# Altium project V5_BASE.PrjPcb
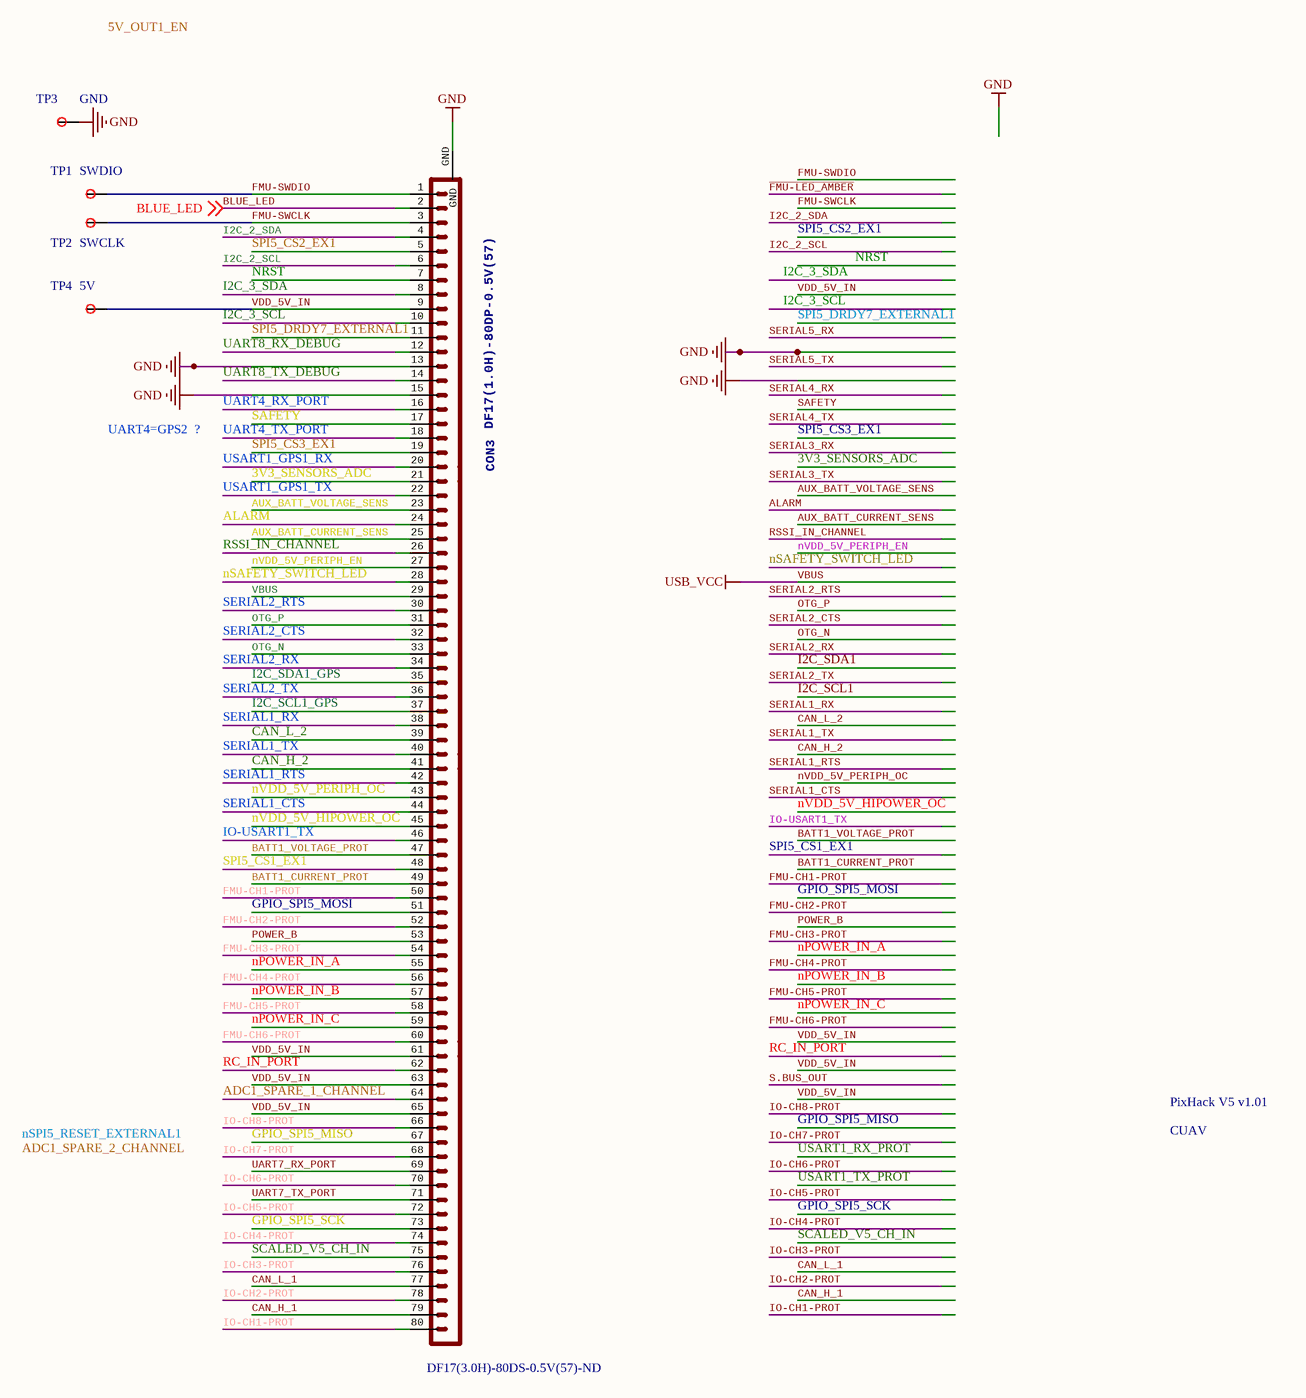
[diagram p0: 02_B_TO_B_CON.SchDoc]
4 sheets, 59 parts. Net scope: global (net labels, ports and power ports of the same name join across sheets).
Board file: V5_BASE_V15.PcbDoc
Sheets:
  02_B_TO_B_CON.SchDoc
  05_DATA_IO.SchDoc
  06_PWM_IO.SchDoc
  07_ONB_COMPASS.SchDoc

## Sheet 02_B_TO_B_CON.SchDoc
size A3

### Parts
CON3  DF17(1.0H)-80DP-0.5V(57)  Supplier Part Number 1: DF17(3.0H)-80DS-0.5V(57)-ND  [DF17(1.0H)-80DP-0.5V(57)]
PixHack_V5_v1.01  CUAV  [CUAV]
TP1  SWDIO  [TP0.75]
TP2  SWCLK  [TP0.75]
TP3  GND  [TP0.75]
TP4  5V  [TP0.75]

### Nets
GND: CON3.13 CON3.15 CON3.GND TP3.0
VBUS: CON3.29  [also labelled USB_VCC]
VDD_5V_IN: CON3.9 CON3.61 CON3.63 CON3.65 TP4.0
3V3_SENSORS_ADC: CON3.21
ADC1_SPARE_1_CHANNEL: CON3.64
ALARM: CON3.24
AUX_BATT_CURRENT_SENS: CON3.25
AUX_BATT_VOLTAGE_SENS: CON3.23
BATT1_CURRENT_PROT: CON3.49
BATT1_VOLTAGE_PROT: CON3.47
BLUE_LED: CON3.2 ; off-sheet BLUE_LED
CAN_H_1: CON3.79
CAN_H_2: CON3.41
CAN_L_1: CON3.77
CAN_L_2: CON3.39
FMU-CH1-PROT: CON3.50
FMU-CH2-PROT: CON3.52
FMU-CH3-PROT: CON3.54
FMU-CH4-PROT: CON3.56
FMU-CH5-PROT: CON3.58
FMU-CH6-PROT: CON3.60
FMU-SWCLK: CON3.3 TP2.0
FMU-SWDIO: CON3.1 TP1.0
GPIO_SPI5_MISO: CON3.67
GPIO_SPI5_MOSI: CON3.51
GPIO_SPI5_SCK: CON3.73
I2C_2_SCL: CON3.6
I2C_2_SDA: CON3.4
I2C_3_SCL: CON3.10
I2C_3_SDA: CON3.8
I2C_SCL1_GPS: CON3.37
I2C_SDA1_GPS: CON3.35
IO-CH1-PROT: CON3.80
IO-CH2-PROT: CON3.78
IO-CH3-PROT: CON3.76
IO-CH4-PROT: CON3.74
IO-CH5-PROT: CON3.72
IO-CH6-PROT: CON3.70
IO-CH7-PROT: CON3.68
IO-CH8-PROT: CON3.66
IO-USART1_TX: CON3.46
nPOWER_IN_A: CON3.55
nPOWER_IN_B: CON3.57
nPOWER_IN_C: CON3.59
NRST: CON3.7
nSAFETY_SWITCH_LED: CON3.28
nVDD_5V_HIPOWER_OC: CON3.45
nVDD_5V_PERIPH_EN: CON3.27
nVDD_5V_PERIPH_OC: CON3.43
OTG_N: CON3.33
OTG_P: CON3.31
POWER_B: CON3.53
RC_IN_PORT: CON3.62
RSSI_IN_CHANNEL: CON3.26
SAFETY: CON3.17
SCALED_V5_CH_IN: CON3.75
SERIAL1_CTS: CON3.44
SERIAL1_RTS: CON3.42
SERIAL1_RX: CON3.38
SERIAL1_TX: CON3.40
SERIAL2_CTS: CON3.32
SERIAL2_RTS: CON3.30
SERIAL2_RX: CON3.34
SERIAL2_TX: CON3.36
SPI5_CS1_EX1: CON3.48
SPI5_CS2_EX1: CON3.5
SPI5_CS3_EX1: CON3.19
SPI5_DRDY7_EXTERNAL1: CON3.11
UART4_RX_PORT: CON3.16
UART4_TX_PORT: CON3.18
UART7_RX_PORT: CON3.69
UART7_TX_PORT: CON3.71
UART8_RX_DEBUG: CON3.12
UART8_TX_DEBUG: CON3.14
USART1_GPS1_RX: CON3.20
USART1_GPS1_TX: CON3.22

### Notes on the sheet
- Labels drawn without touching a wire or pin: 5V_OUT1_EN, ADC1_SPARE_2_CHANNEL, nSPI5_RESET_EXTERNAL1, UART4=GPS2  ?

### Library data of the parts
CON3 = CON-DF17-80F: CONN RECEPT 80POS .5MM SMD W/FIT; 3DR_PARTNO: ECM0518; PARTNO: DF17(3.0H)-80DS-0.5V(57); Supplier 1: Digi-Key
TP1-TP4 = TP_0.75: TP_0.75MM

## Sheet 05_DATA_IO.SchDoc
size A4
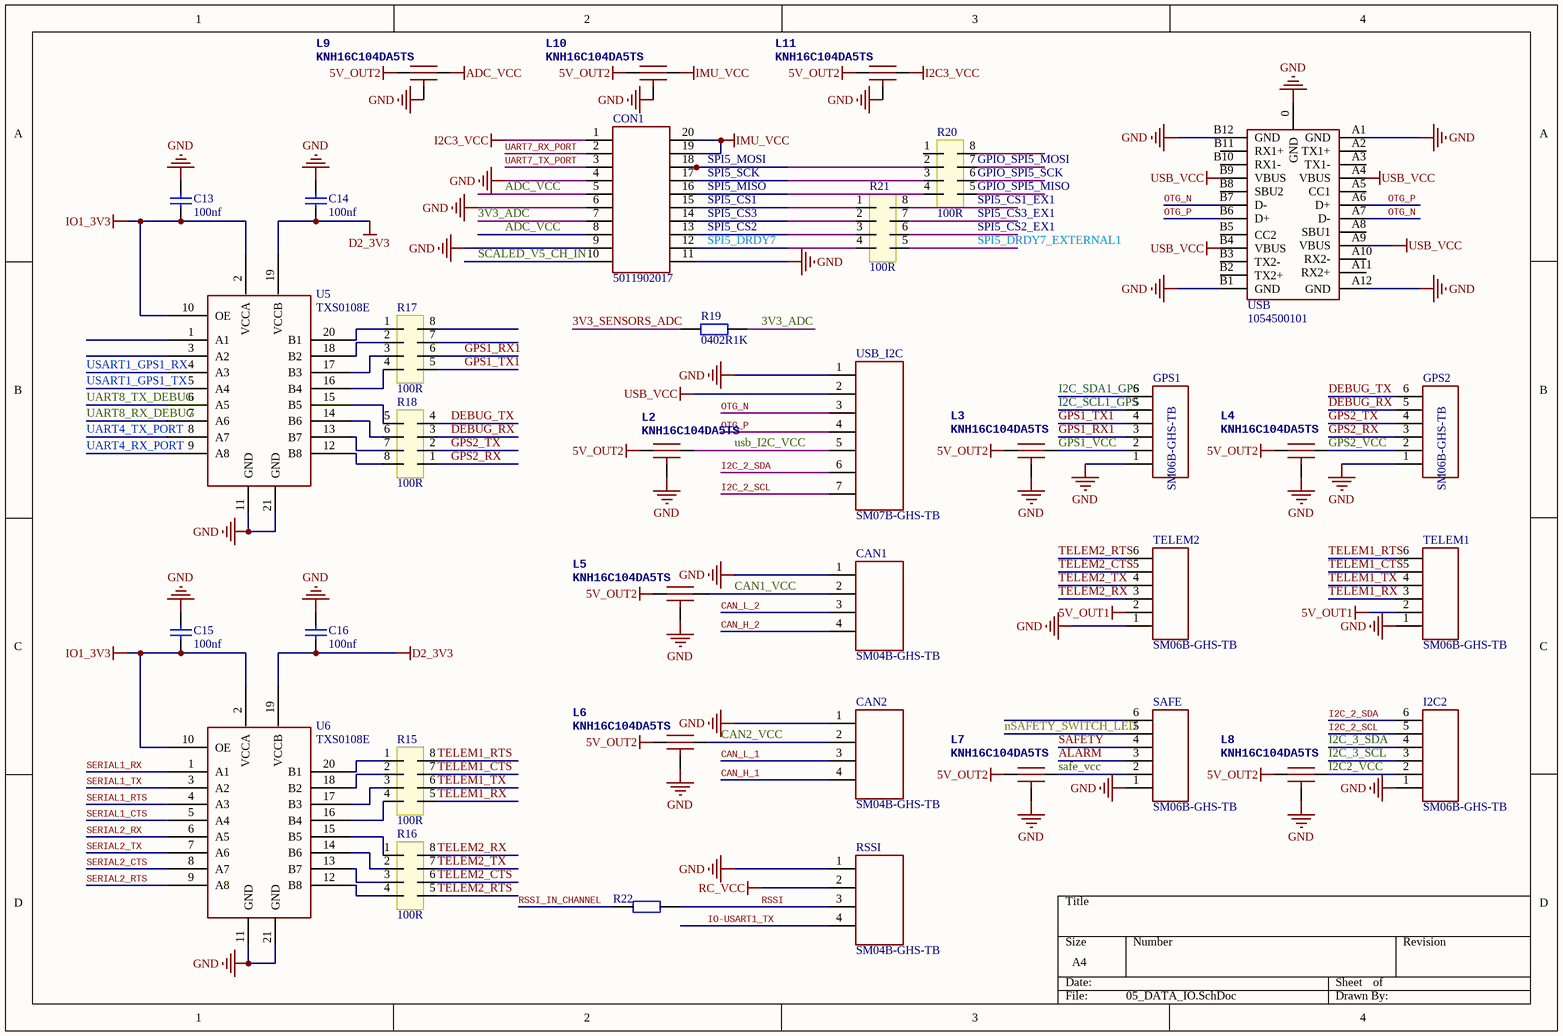
[diagram p1: 05_DATA_IO.SchDoc]

### Parts
C13  100nf  [0402CAP]
C14  100nf  [0402CAP]
C15  100nf  [0402CAP]
C16  100nf  [0402CAP]
CAN1  SM04B-GHS-TB  [BM04B-GHS]
CAN2  SM04B-GHS-TB  [BM04B-GHS]
CON1  5011902017  [5011902017]
GPS1  SM06B-GHS-TB  [SM06B-GHS-TB]
GPS2  SM06B-GHS-TB  [SM06B-GHS-TB]
I2C2  SM06B-GHS-TB  [SM06B-GHS-TB]
L2  KNH16C104DA5TS  [KYOCERA-KNH16-DA]
L3  KNH16C104DA5TS  [KYOCERA-KNH16-DA]
L4  KNH16C104DA5TS  [KYOCERA-KNH16-DA]
L5  KNH16C104DA5TS  [KYOCERA-KNH16-DA]
L6  KNH16C104DA5TS  [KYOCERA-KNH16-DA]
L7  KNH16C104DA5TS  [KYOCERA-KNH16-DA]
L8  KNH16C104DA5TS  [KYOCERA-KNH16-DA]
L9  KNH16C104DA5TS  [KYOCERA-KNH16-DA]
L10  KNH16C104DA5TS  [KYOCERA-KNH16-DA]
L11  KNH16C104DA5TS  [KYOCERA-KNH16-DA]
R15  100R  [0402_4r]
R16  100R  [0402_4r]
R17  100R  [0402_4r]
R18  100R  [0402_4r]
R19  0402R1K  [0402R]
R20  100R  [0402_4r]
R21  100R  [0402_4r]
R22  0402R100R  [0402R]  (value not drawn)
RSSI  SM04B-GHS-TB  [BM04B-GHS]
SAFE  SM06B-GHS-TB  [SM06B-GHS-TB]
TELEM1  SM06B-GHS-TB  [SM06B-GHS-TB]
TELEM2  SM06B-GHS-TB  [SM06B-GHS-TB]
U5  TXS0108E  [VQFN20]
U6  TXS0108E  [VQFN20]
USB  1054500101  [1054500101]
USB_I2C  SM07B-GHS-TB  [SM07B-GHS-TB]

### Nets
5V_OUT1: TELEM1.2 TELEM2.2
5V_OUT2: L2.P$1 L3.P$1 L4.P$1 L5.P$1 L6.P$1 L7.P$1 L8.P$1 L9.P$1 L10.P$1 L11.P$1
ADC_VCC: CON1.5 CON1.8 L9.P$2
D2_3V3: C14.2 C16.2 U5.19(VCCB) U6.19(VCCB)
GND: C13.1 C14.1 C15.1 C16.1 CAN1.1 CAN2.1 CON1.4 CON1.6 CON1.9 CON1.11 GPS1.1 GPS2.1 I2C2.1 L2.GND L3.GND L4.GND L5.GND L6.GND L7.GND L8.GND L9.GND L10.GND L11.GND RSSI.1 SAFE.1 TELEM1.1 TELEM2.1 U5.11(GND) U5.21(GND) U6.11(GND) U6.21(GND) USB.0(GND) USB.A1(GND) USB.A12(GND) USB.B1(GND) USB.B12(GND) USB_I2C.1
I2C3_VCC: CON1.1 L11.P$2
IMU_VCC: CON1.19 CON1.20 L10.P$2
IO1_3V3: C13.2 C15.2 U5.2(VCCA) U5.10(OE) U6.2(VCCA) U6.10(OE)
RC_VCC: RSSI.2
USB_VCC: USB.A4(VBUS) USB.A9(VBUS) USB.B4(VBUS) USB.B9(VBUS) USB_I2C.2  [project net VBUS]
3V3_ADC: CON1.7 R19.2
3V3_SENSORS_ADC: R19.1
ALARM: SAFE.3
CAN1_VCC: CAN1.2 L5.P$2
CAN2_VCC: CAN2.2 L6.P$2
CAN_H_1: CAN2.4
CAN_H_2: CAN1.4
CAN_L_1: CAN2.3
CAN_L_2: CAN1.3
DEBUG_RX: GPS2.5 R18.3
DEBUG_TX: GPS2.6 R18.4
GPIO_SPI5_MISO: R20.5
GPIO_SPI5_MOSI: R20.7
GPIO_SPI5_SCK: R20.6
GPS1_RX1: GPS1.3 R17.6
GPS1_TX1: GPS1.4 R17.5
GPS1_VCC: GPS1.2 L3.P$2
GPS2_RX: GPS2.3 R18.1
GPS2_TX: GPS2.4 R18.2
GPS2_VCC: GPS2.2 L4.P$2
I2C2_VCC: I2C2.2 L8.P$2
I2C_2_SCL: I2C2.5 USB_I2C.7
I2C_2_SDA: I2C2.6 USB_I2C.6
I2C_3_SCL: I2C2.3
I2C_3_SDA: I2C2.4
I2C_SCL1_GPS: GPS1.5
I2C_SDA1_GPS: GPS1.6
IO-USART1_TX: RSSI.4
nSAFETY_SWITCH_LED: SAFE.5
OTG_N: USB.A7(D-) USB.B7(D-) USB_I2C.3
OTG_P: USB.A6(D+) USB.B6(D+) USB_I2C.4
RSSI: R22.2 RSSI.3
RSSI_IN_CHANNEL: R22.1
safe_vcc: L7.P$2 SAFE.2
SAFETY: SAFE.4
SCALED_V5_CH_IN: CON1.10
SERIAL1_CTS: U6.5(A4)
SERIAL1_RTS: U6.4(A3)
SERIAL1_RX: U6.1(A1)
SERIAL1_TX: U6.3(A2)
SERIAL2_CTS: U6.8(A7)
SERIAL2_RTS: U6.9(A8)
SERIAL2_RX: U6.6(A5)
SERIAL2_TX: U6.7(A6)
SPI5_CS1: CON1.15 R21.1
SPI5_CS1_EX1: R21.8
SPI5_CS2: CON1.13 R21.3
SPI5_CS2_EX1: R21.6
SPI5_CS3: CON1.14 R21.2
SPI5_CS3_EX1: R21.7
SPI5_DRDY7: CON1.12 R21.4
SPI5_DRDY7_EXTERNAL1: R21.5
SPI5_MISO: CON1.16 R20.4
SPI5_MOSI: CON1.18 R20.2
SPI5_SCK: CON1.17 R20.3
TELEM1_CTS: R15.7 TELEM1.5
TELEM1_RTS: R15.8 TELEM1.6
TELEM1_RX: R15.5 TELEM1.3
TELEM1_TX: R15.6 TELEM1.4
TELEM2_CTS: R16.6 TELEM2.5
TELEM2_RTS: R16.5 TELEM2.6
TELEM2_RX: R16.8 TELEM2.3
TELEM2_TX: R16.7 TELEM2.4
UART4_RX_PORT: U5.9(A8)
UART4_TX_PORT: U5.8(A7)
UART7_RX_PORT: CON1.2
UART7_TX_PORT: CON1.3
UART8_RX_DEBUG: U5.7(A6)
UART8_TX_DEBUG: U5.6(A5)
USART1_GPS1_RX: U5.4(A3)
USART1_GPS1_TX: U5.5(A4)
usb_I2C_VCC: L2.P$2 USB_I2C.5
NetR15_1: R15.1 U6.20(B1)
NetR15_2: R15.2 U6.18(B2)
NetR15_3: R15.3 U6.17(B3)
NetR15_4: R15.4 U6.16(B4)
NetR16_1: R16.1 U6.15(B5)
NetR16_2: R16.2 U6.14(B6)
NetR16_3: R16.3 U6.13(B7)
NetR16_4: R16.4 U6.12(B8)
NetR17_1: R17.1 U5.20(B1)
NetR17_2: R17.2 U5.18(B2)
NetR17_3: R17.3 U5.17(B3)
NetR17_4: R17.4 U5.16(B4)
NetR18_5: R18.5 U5.15(B5)
NetR18_6: R18.6 U5.14(B6)
NetR18_7: R18.7 U5.13(B7)
NetR18_8: R18.8 U5.12(B8)

Not connected (* = marked no-connect by the designer): R17 7 8; R20 1 8; SAFE 6; U5 1(A1) 3(A2); USB A2(TX1+) A3(TX1-) A5(CC1) A8(SBU1) A10(RX2-) A11(RX2+) B2(TX2+) B3(TX2-) B5(CC2) B8(SBU2) B10(RX1-) B11(RX1+)

### Library data of the parts
C13-C16 = Cap
L2-L11 = KNH16C104DA5TS: Capacitor, Filter, 0.1uF, 25V, 2A, 0603, SMD; 3DR_PARTNO: ECM0719; Supplier 1: Digi-Key
R15-R18 R20 R21 = 0402-8R-4R
R19 = 0402R1K: 0402R1K 1%
R22 = 0402R100R: 0402R100R 1%

## Sheet 06_PWM_IO.SchDoc
size A4
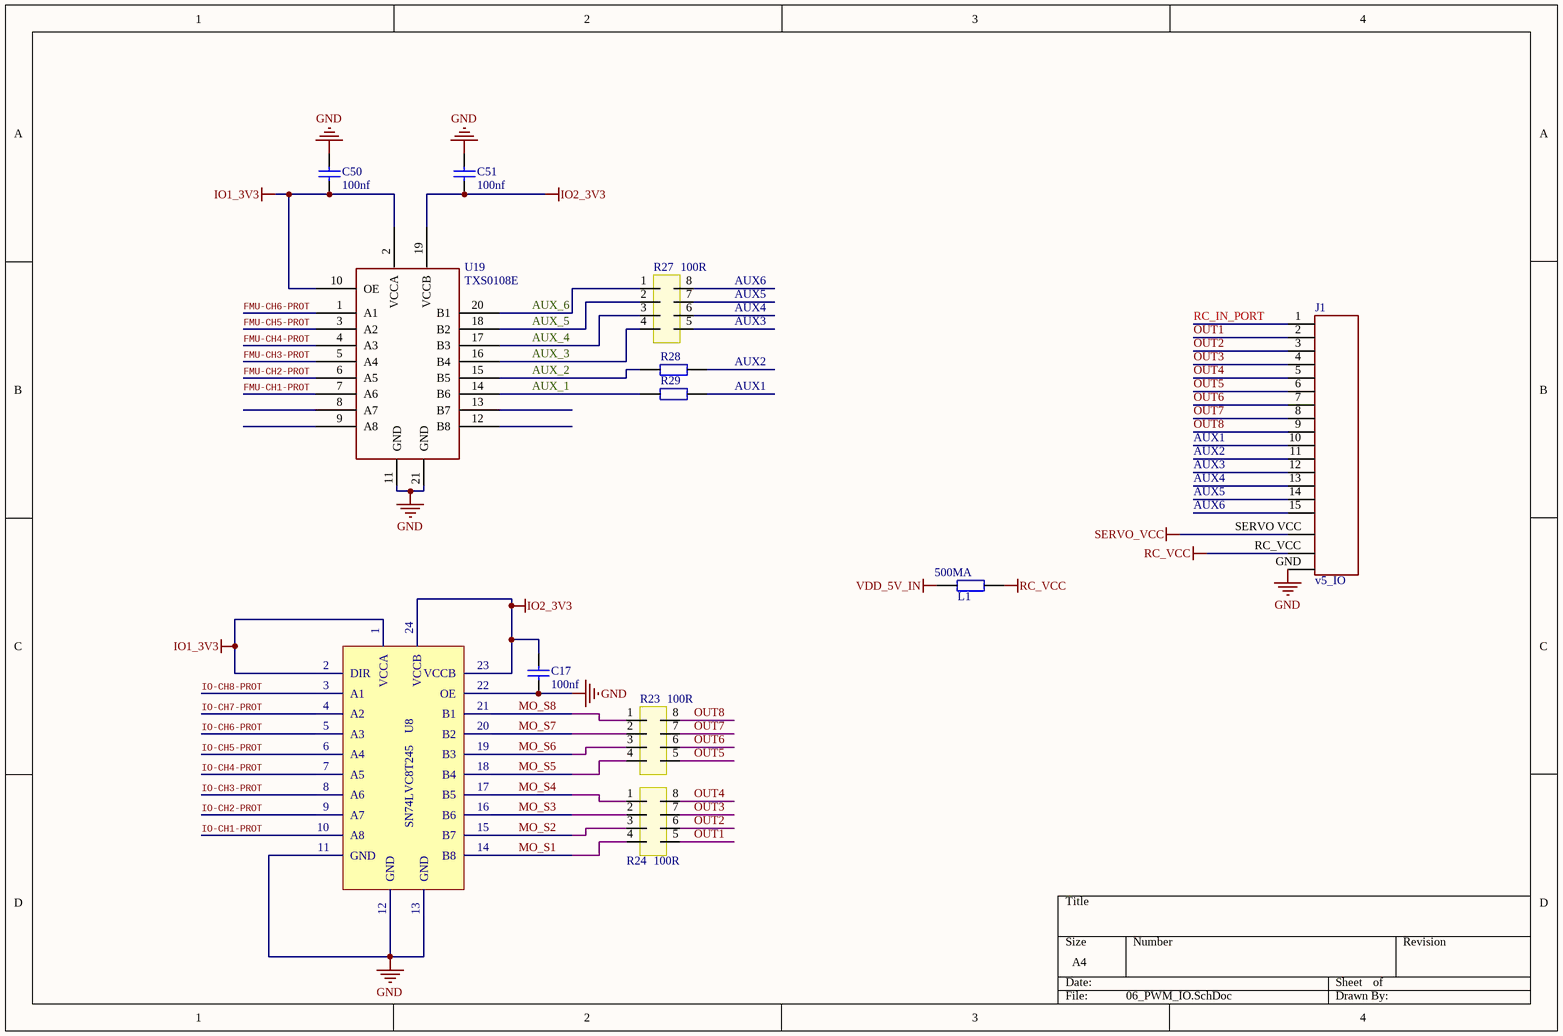
[diagram p2: 06_PWM_IO.SchDoc]

### Parts
C17  100nf  [0402CAP]
C50  100nf  [0402CAP]
C51  100nf  [0402CAP]
J1  v5_IO  [V5_IO_PWM]
L1  500MA  [0805l]
R23  100R  [0402_4r]
R24  100R  [0402_4r]
R27  100R  [0402_4r]
R28  0402R100R  [0402R]  (value not drawn)
R29  0402R100R  [0402R]  (value not drawn)
U8  SN74LVC8T245  [QFN24-RGY]
U19  TXS0108E  [VQFN20]

### Nets
GND: C17.1 C50.1 C51.1 J1.GND U8.11(GND) U8.12(GND) U8.13(GND) U8.22(OE) U19.11(GND) U19.21(GND)
IO1_3V3: C50.2 U8.1(VCCA) U8.2(DIR) U19.2(VCCA) U19.10(OE)
IO2_3V3: C17.2 C51.2 U8.23(VCCB) U8.24(VCCB) U19.19(VCCB)
RC_VCC: J1.RC_VCC L1.1
SERVO_VCC: J1.SERVO_VCC
VDD_5V_IN: L1.2
AUX1: J1.10 R29.2
AUX2: J1.11 R28.2
AUX3: J1.12 R27.5
AUX4: J1.13 R27.6
AUX5: J1.14 R27.7
AUX6: J1.15 R27.8
AUX_1: R29.1 U19.14(B6)
AUX_2: R28.1 U19.15(B5)
AUX_3: R27.4 U19.16(B4)
AUX_4: R27.3 U19.17(B3)
AUX_5: R27.2 U19.18(B2)
AUX_6: R27.1 U19.20(B1)
FMU-CH1-PROT: U19.7(A6)
FMU-CH2-PROT: U19.6(A5)
FMU-CH3-PROT: U19.5(A4)
FMU-CH4-PROT: U19.4(A3)
FMU-CH5-PROT: U19.3(A2)
FMU-CH6-PROT: U19.1(A1)
IO-CH1-PROT: U8.10(A8)
IO-CH2-PROT: U8.9(A7)
IO-CH3-PROT: U8.8(A6)
IO-CH4-PROT: U8.7(A5)
IO-CH5-PROT: U8.6(A4)
IO-CH6-PROT: U8.5(A3)
IO-CH7-PROT: U8.4(A2)
IO-CH8-PROT: U8.3(A1)
MO_S1: R24.4 U8.14(B8)
MO_S2: R24.3 U8.15(B7)
MO_S3: R24.2 U8.16(B6)
MO_S4: R24.1 U8.17(B5)
MO_S5: R23.4 U8.18(B4)
MO_S6: R23.3 U8.19(B3)
MO_S7: R23.2 U8.20(B2)
MO_S8: R23.1 U8.21(B1)
OUT1: J1.2 R24.5
OUT2: J1.3 R24.6
OUT3: J1.4 R24.7
OUT4: J1.5 R24.8
OUT5: J1.6 R23.5
OUT6: J1.7 R23.6
OUT7: J1.8 R23.7
OUT8: J1.9 R23.8
RC_IN_PORT: J1.1

Not connected (* = marked no-connect by the designer): U19 8(A7) 9(A8) 12(B8) 13(B7)

### Library data of the parts
C17 = Cap: Value: 100pF; Published: 8-Jun-2000; LatestRevisionDate: 17-Jul-2002; LatestRevisionNote: Re-released for DXP Platform.; PackageReference: RAD-0.3; Publisher: Altium Limited; PackageDescription: Radial Cap, Thru-Hole; 2 Leads; 0.3 in Pin Spacing
C50 C51 = Cap
L1 R28 R29 = 0402R100R: 0402R100R 1%
R23 R24 R27 = 0402-8R-4R

## Sheet 07_ONB_COMPASS.SchDoc
size A4
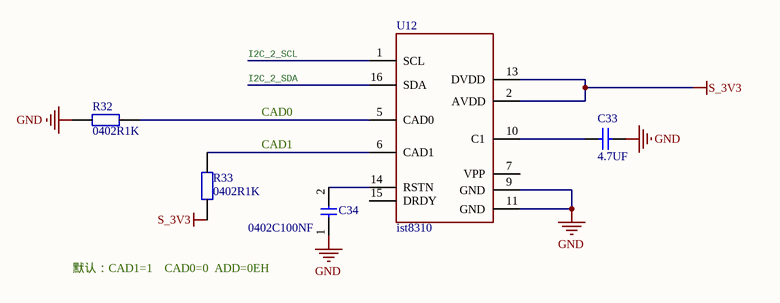
[diagram p3: 07_ONB_COMPASS.SchDoc]

### Parts
C33  4.7UF  [0805CAP]
C34  0402C100NF  [0402C]
R32  0402R1K  [0402R]
R33  0402R1K  [0402R]
U12  ist8310  [LGA16_4X4]

### Nets
GND: C33.2 C34.1 R32.2 U12.9(GND) U12.11(GND)
S_3V3: R33.1 U12.2(AVDD) U12.13(DVDD)
CAD0: R32.1 U12.5(CAD0)
CAD1: R33.2 U12.6(CAD1)
I2C_2_SCL: U12.1(SCL)
I2C_2_SDA: U12.16(SDA)
NetC33_1: C33.1 U12.10(C1)
NetC34_2: C34.2 U12.14(RSTN)

Not connected (* = marked no-connect by the designer): U12 7(VPP) 15(DRDY)

### Notes on the sheet
- Labels drawn without touching a wire or pin: 默认：CAD1=1    CAD0=0  ADD=0EH

### Library data of the parts
C33 = Cap: Capacitor
C34 = 0402C100NF: 50V 5%
R32 R33 = 0402R1K: 0402R1K 1%

## Nets that join several sheets
GND: 02_B_TO_B_CON (CON3.13 CON3.15 CON3.GND TP3.0), 05_DATA_IO (37 pins), 06_PWM_IO (10 pins), 07_ONB_COMPASS (5 pins)
IO1_3V3: 05_DATA_IO (6 pins), 06_PWM_IO (5 pins)
RC_VCC: 05_DATA_IO (RSSI.2), 06_PWM_IO (J1.RC_VCC L1.1)
VBUS: 02_B_TO_B_CON (CON3.29), 05_DATA_IO (5 pins)
VDD_5V_IN: 02_B_TO_B_CON (5 pins), 06_PWM_IO (L1.2)
3V3_SENSORS_ADC: 02_B_TO_B_CON (CON3.21), 05_DATA_IO (R19.1)
ALARM: 02_B_TO_B_CON (CON3.24), 05_DATA_IO (SAFE.3)
CAN_H_1: 02_B_TO_B_CON (CON3.79), 05_DATA_IO (CAN2.4)
CAN_H_2: 02_B_TO_B_CON (CON3.41), 05_DATA_IO (CAN1.4)
CAN_L_1: 02_B_TO_B_CON (CON3.77), 05_DATA_IO (CAN2.3)
CAN_L_2: 02_B_TO_B_CON (CON3.39), 05_DATA_IO (CAN1.3)
FMU-CH1-PROT: 02_B_TO_B_CON (CON3.50), 06_PWM_IO (U19.7)
FMU-CH2-PROT: 02_B_TO_B_CON (CON3.52), 06_PWM_IO (U19.6)
FMU-CH3-PROT: 02_B_TO_B_CON (CON3.54), 06_PWM_IO (U19.5)
FMU-CH4-PROT: 02_B_TO_B_CON (CON3.56), 06_PWM_IO (U19.4)
FMU-CH5-PROT: 02_B_TO_B_CON (CON3.58), 06_PWM_IO (U19.3)
FMU-CH6-PROT: 02_B_TO_B_CON (CON3.60), 06_PWM_IO (U19.1)
GPIO_SPI5_MISO: 02_B_TO_B_CON (CON3.67), 05_DATA_IO (R20.5)
GPIO_SPI5_MOSI: 02_B_TO_B_CON (CON3.51), 05_DATA_IO (R20.7)
GPIO_SPI5_SCK: 02_B_TO_B_CON (CON3.73), 05_DATA_IO (R20.6)
I2C_2_SCL: 02_B_TO_B_CON (CON3.6), 05_DATA_IO (I2C2.5 USB_I2C.7), 07_ONB_COMPASS (U12.1)
I2C_2_SDA: 02_B_TO_B_CON (CON3.4), 05_DATA_IO (I2C2.6 USB_I2C.6), 07_ONB_COMPASS (U12.16)
I2C_3_SCL: 02_B_TO_B_CON (CON3.10), 05_DATA_IO (I2C2.3)
I2C_3_SDA: 02_B_TO_B_CON (CON3.8), 05_DATA_IO (I2C2.4)
I2C_SCL1_GPS: 02_B_TO_B_CON (CON3.37), 05_DATA_IO (GPS1.5)
I2C_SDA1_GPS: 02_B_TO_B_CON (CON3.35), 05_DATA_IO (GPS1.6)
IO-CH1-PROT: 02_B_TO_B_CON (CON3.80), 06_PWM_IO (U8.10)
IO-CH2-PROT: 02_B_TO_B_CON (CON3.78), 06_PWM_IO (U8.9)
IO-CH3-PROT: 02_B_TO_B_CON (CON3.76), 06_PWM_IO (U8.8)
IO-CH4-PROT: 02_B_TO_B_CON (CON3.74), 06_PWM_IO (U8.7)
IO-CH5-PROT: 02_B_TO_B_CON (CON3.72), 06_PWM_IO (U8.6)
IO-CH6-PROT: 02_B_TO_B_CON (CON3.70), 06_PWM_IO (U8.5)
IO-CH7-PROT: 02_B_TO_B_CON (CON3.68), 06_PWM_IO (U8.4)
IO-CH8-PROT: 02_B_TO_B_CON (CON3.66), 06_PWM_IO (U8.3)
IO-USART1_TX: 02_B_TO_B_CON (CON3.46), 05_DATA_IO (RSSI.4)
nSAFETY_SWITCH_LED: 02_B_TO_B_CON (CON3.28), 05_DATA_IO (SAFE.5)
OTG_N: 02_B_TO_B_CON (CON3.33), 05_DATA_IO (USB.A7 USB.B7 USB_I2C.3)
OTG_P: 02_B_TO_B_CON (CON3.31), 05_DATA_IO (USB.A6 USB.B6 USB_I2C.4)
RC_IN_PORT: 02_B_TO_B_CON (CON3.62), 06_PWM_IO (J1.1)
RSSI_IN_CHANNEL: 02_B_TO_B_CON (CON3.26), 05_DATA_IO (R22.1)
SAFETY: 02_B_TO_B_CON (CON3.17), 05_DATA_IO (SAFE.4)
SCALED_V5_CH_IN: 02_B_TO_B_CON (CON3.75), 05_DATA_IO (CON1.10)
SERIAL1_CTS: 02_B_TO_B_CON (CON3.44), 05_DATA_IO (U6.5)
SERIAL1_RTS: 02_B_TO_B_CON (CON3.42), 05_DATA_IO (U6.4)
SERIAL1_RX: 02_B_TO_B_CON (CON3.38), 05_DATA_IO (U6.1)
SERIAL1_TX: 02_B_TO_B_CON (CON3.40), 05_DATA_IO (U6.3)
SERIAL2_CTS: 02_B_TO_B_CON (CON3.32), 05_DATA_IO (U6.8)
SERIAL2_RTS: 02_B_TO_B_CON (CON3.30), 05_DATA_IO (U6.9)
SERIAL2_RX: 02_B_TO_B_CON (CON3.34), 05_DATA_IO (U6.6)
SERIAL2_TX: 02_B_TO_B_CON (CON3.36), 05_DATA_IO (U6.7)
SPI5_CS1_EX1: 02_B_TO_B_CON (CON3.48), 05_DATA_IO (R21.8)
SPI5_CS2_EX1: 02_B_TO_B_CON (CON3.5), 05_DATA_IO (R21.6)
SPI5_CS3_EX1: 02_B_TO_B_CON (CON3.19), 05_DATA_IO (R21.7)
SPI5_DRDY7_EXTERNAL1: 02_B_TO_B_CON (CON3.11), 05_DATA_IO (R21.5)
UART4_RX_PORT: 02_B_TO_B_CON (CON3.16), 05_DATA_IO (U5.9)
UART4_TX_PORT: 02_B_TO_B_CON (CON3.18), 05_DATA_IO (U5.8)
UART7_RX_PORT: 02_B_TO_B_CON (CON3.69), 05_DATA_IO (CON1.2)
UART7_TX_PORT: 02_B_TO_B_CON (CON3.71), 05_DATA_IO (CON1.3)
UART8_RX_DEBUG: 02_B_TO_B_CON (CON3.12), 05_DATA_IO (U5.7)
UART8_TX_DEBUG: 02_B_TO_B_CON (CON3.14), 05_DATA_IO (U5.6)
USART1_GPS1_RX: 02_B_TO_B_CON (CON3.20), 05_DATA_IO (U5.4)
USART1_GPS1_TX: 02_B_TO_B_CON (CON3.22), 05_DATA_IO (U5.5)